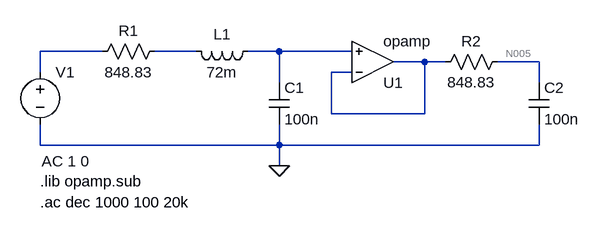
[diagram p0: schematic TS3_Albanesi_SimulacionPunto4.asc]
TS3_Albanesi_SimulacionPunto4.asc, the LTspice schematic file:
Version 4
SHEET 1 880 680
WIRE -16 64 -112 64
WIRE 128 64 64 64
WIRE 256 64 208 64
WIRE 368 64 256 64
WIRE 480 80 432 80
WIRE 512 80 480 80
WIRE 656 80 592 80
WIRE -112 96 -112 64
WIRE 368 96 336 96
WIRE 256 112 256 64
WIRE 656 112 656 80
WIRE 336 160 336 96
WIRE 480 160 480 80
WIRE 480 160 336 160
WIRE -112 208 -112 176
WIRE 256 208 256 176
WIRE 256 208 -112 208
WIRE 656 208 656 176
WIRE 656 208 256 208
WIRE 256 240 256 208
FLAG 256 240 0
SYMBOL voltage -112 80 R0
WINDOW 123 2 153 Left 2
WINDOW 39 0 0 Left 0
SYMATTR Value2 AC 1 0
SYMATTR InstName V1
SYMATTR Value ""
SYMBOL OpAmps\\opamp 400 144 M180
SYMATTR InstName U1
SYMBOL res 80 48 R90
WINDOW 0 0 56 VBottom 2
WINDOW 3 32 56 VTop 2
SYMATTR InstName R1
SYMATTR Value 848.83
SYMBOL res 608 64 R90
WINDOW 0 0 56 VBottom 2
WINDOW 3 32 56 VTop 2
SYMATTR InstName R2
SYMATTR Value 848.83
SYMBOL cap 240 112 R0
SYMATTR InstName C1
SYMATTR Value 100n
SYMBOL cap 640 112 R0
SYMATTR InstName C2
SYMATTR Value 100n
SYMBOL ind 224 48 R90
WINDOW 0 5 56 VBottom 2
WINDOW 3 32 56 VTop 2
SYMATTR InstName L1
SYMATTR Value 72m
TEXT -112 264 Left 2 !.lib opamp.sub
TEXT -112 296 Left 2 !.ac dec 1000 100 20k

The netlist it stands for:
* TS3_Albanesi_SimulacionPunto4.asc
V1 N001 0 AC 1 0
XU1 N004 N003 N004 opamp Aol=100K GBW=10Meg  ; pins invin noninvin out
R1 N002 N001 848.83
R2 N005 N004 848.83
C1 N003 0 100n
C2 N005 0 100n
L1 N003 N002 72m
.lib opamp.sub
.ac dec 1000 100 20k
.backanno
.end

* Results of the author's LTspice run, read from the files saved beside the schematic
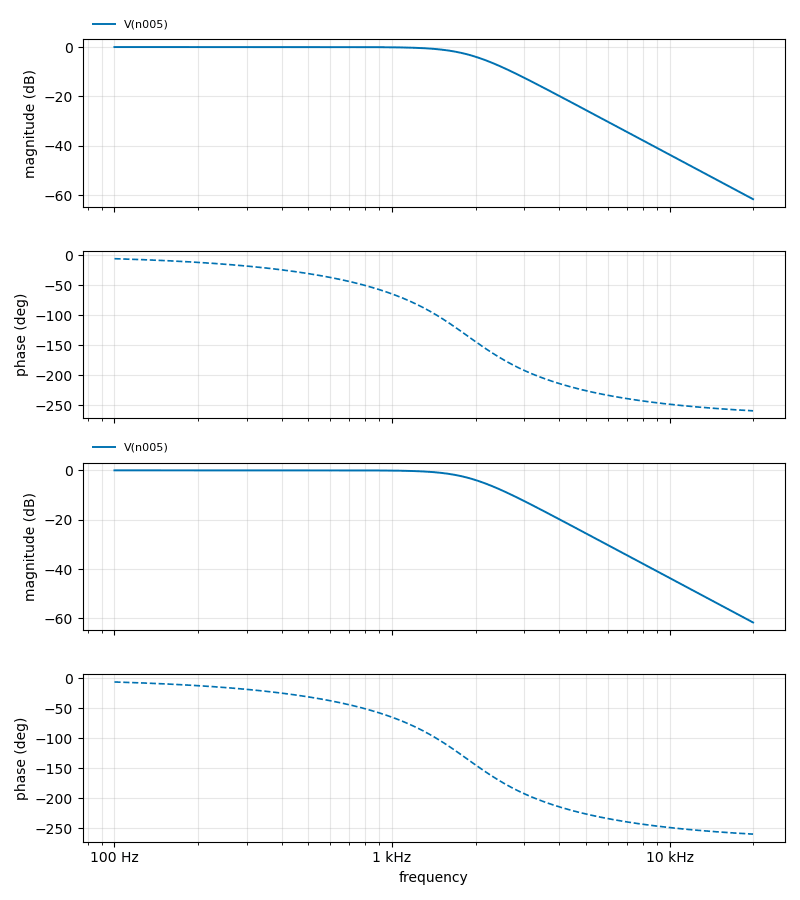
[diagram p1: AC Analysis of TS3_Albanesi_SimulacionPunto4.asc, plotted from the saved traces]
* AC Analysis, 1 run:
*   V(n005): -0.00 dB at 100 Hz, -61.68 dB at 20 kHz, peak -0.00 dB at 100 Hz, 3 dB below the peak at 1.875 kHz
*   V(n005): -0.00 dB at 100 Hz, -61.68 dB at 20 kHz, peak -0.00 dB at 100 Hz, 3 dB below the peak at 1.875 kHz